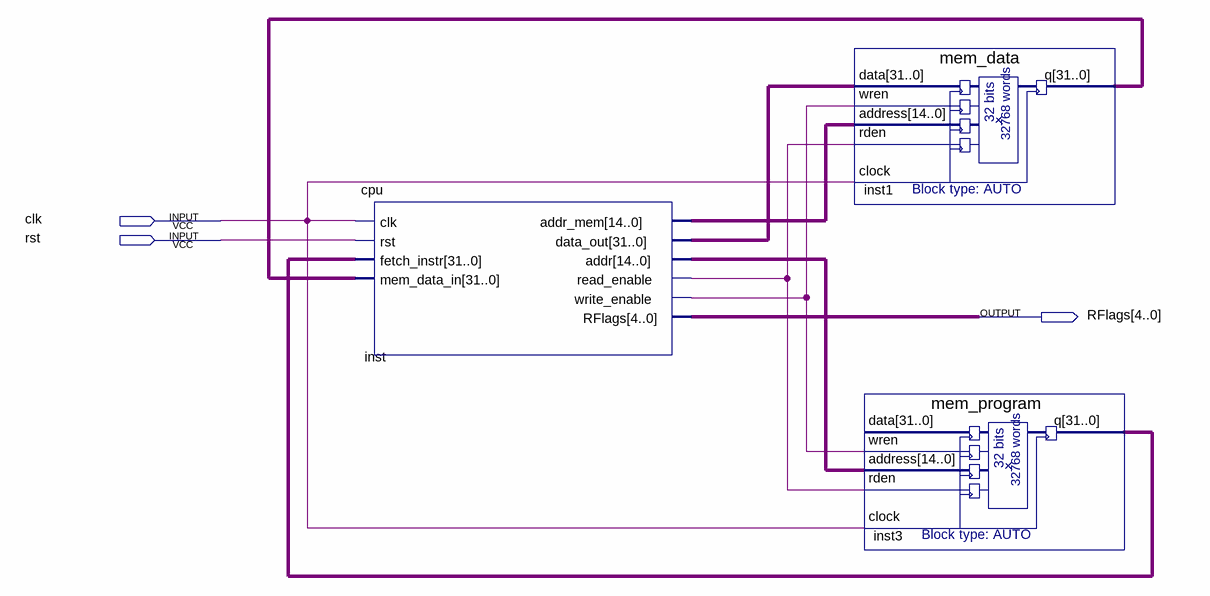
[diagram p0: schematic sheet]
// Quartus schematic processador.bdf as structural Verilog: 3 symbols, 3 pins
module processador (
  input  clk,
  input  rst,
  output [4:0] RFlags
);

  wire inst_read_enable, inst_write_enable;
  wire [14:0] inst_addr, inst_addr_mem;
  wire [31:0] inst1_q, inst3_q, inst_data_out;

  cpu inst (
    .clk(clk), .rst(rst), .fetch_instr(inst3_q), .mem_data_in(inst1_q), .addr_mem(inst_addr_mem),
    .data_out(inst_data_out), .addr(inst_addr), .read_enable(inst_read_enable),
    .write_enable(inst_write_enable), .RFlags(RFlags));
  mem_data inst1 (
    .data(inst_data_out), .wren(inst_write_enable), .address(inst_addr_mem), .rden(inst_read_enable),
    .clock(clk), .q(inst1_q));
  mem_program inst3 (
    .wren(inst_write_enable), .address(inst_addr), .rden(inst_read_enable), .clock(clk), .q(inst3_q));  // open: data
endmodule
